# Altium project LimePSB-RPCM_1v5.PrjPcb (part 8 of 10)
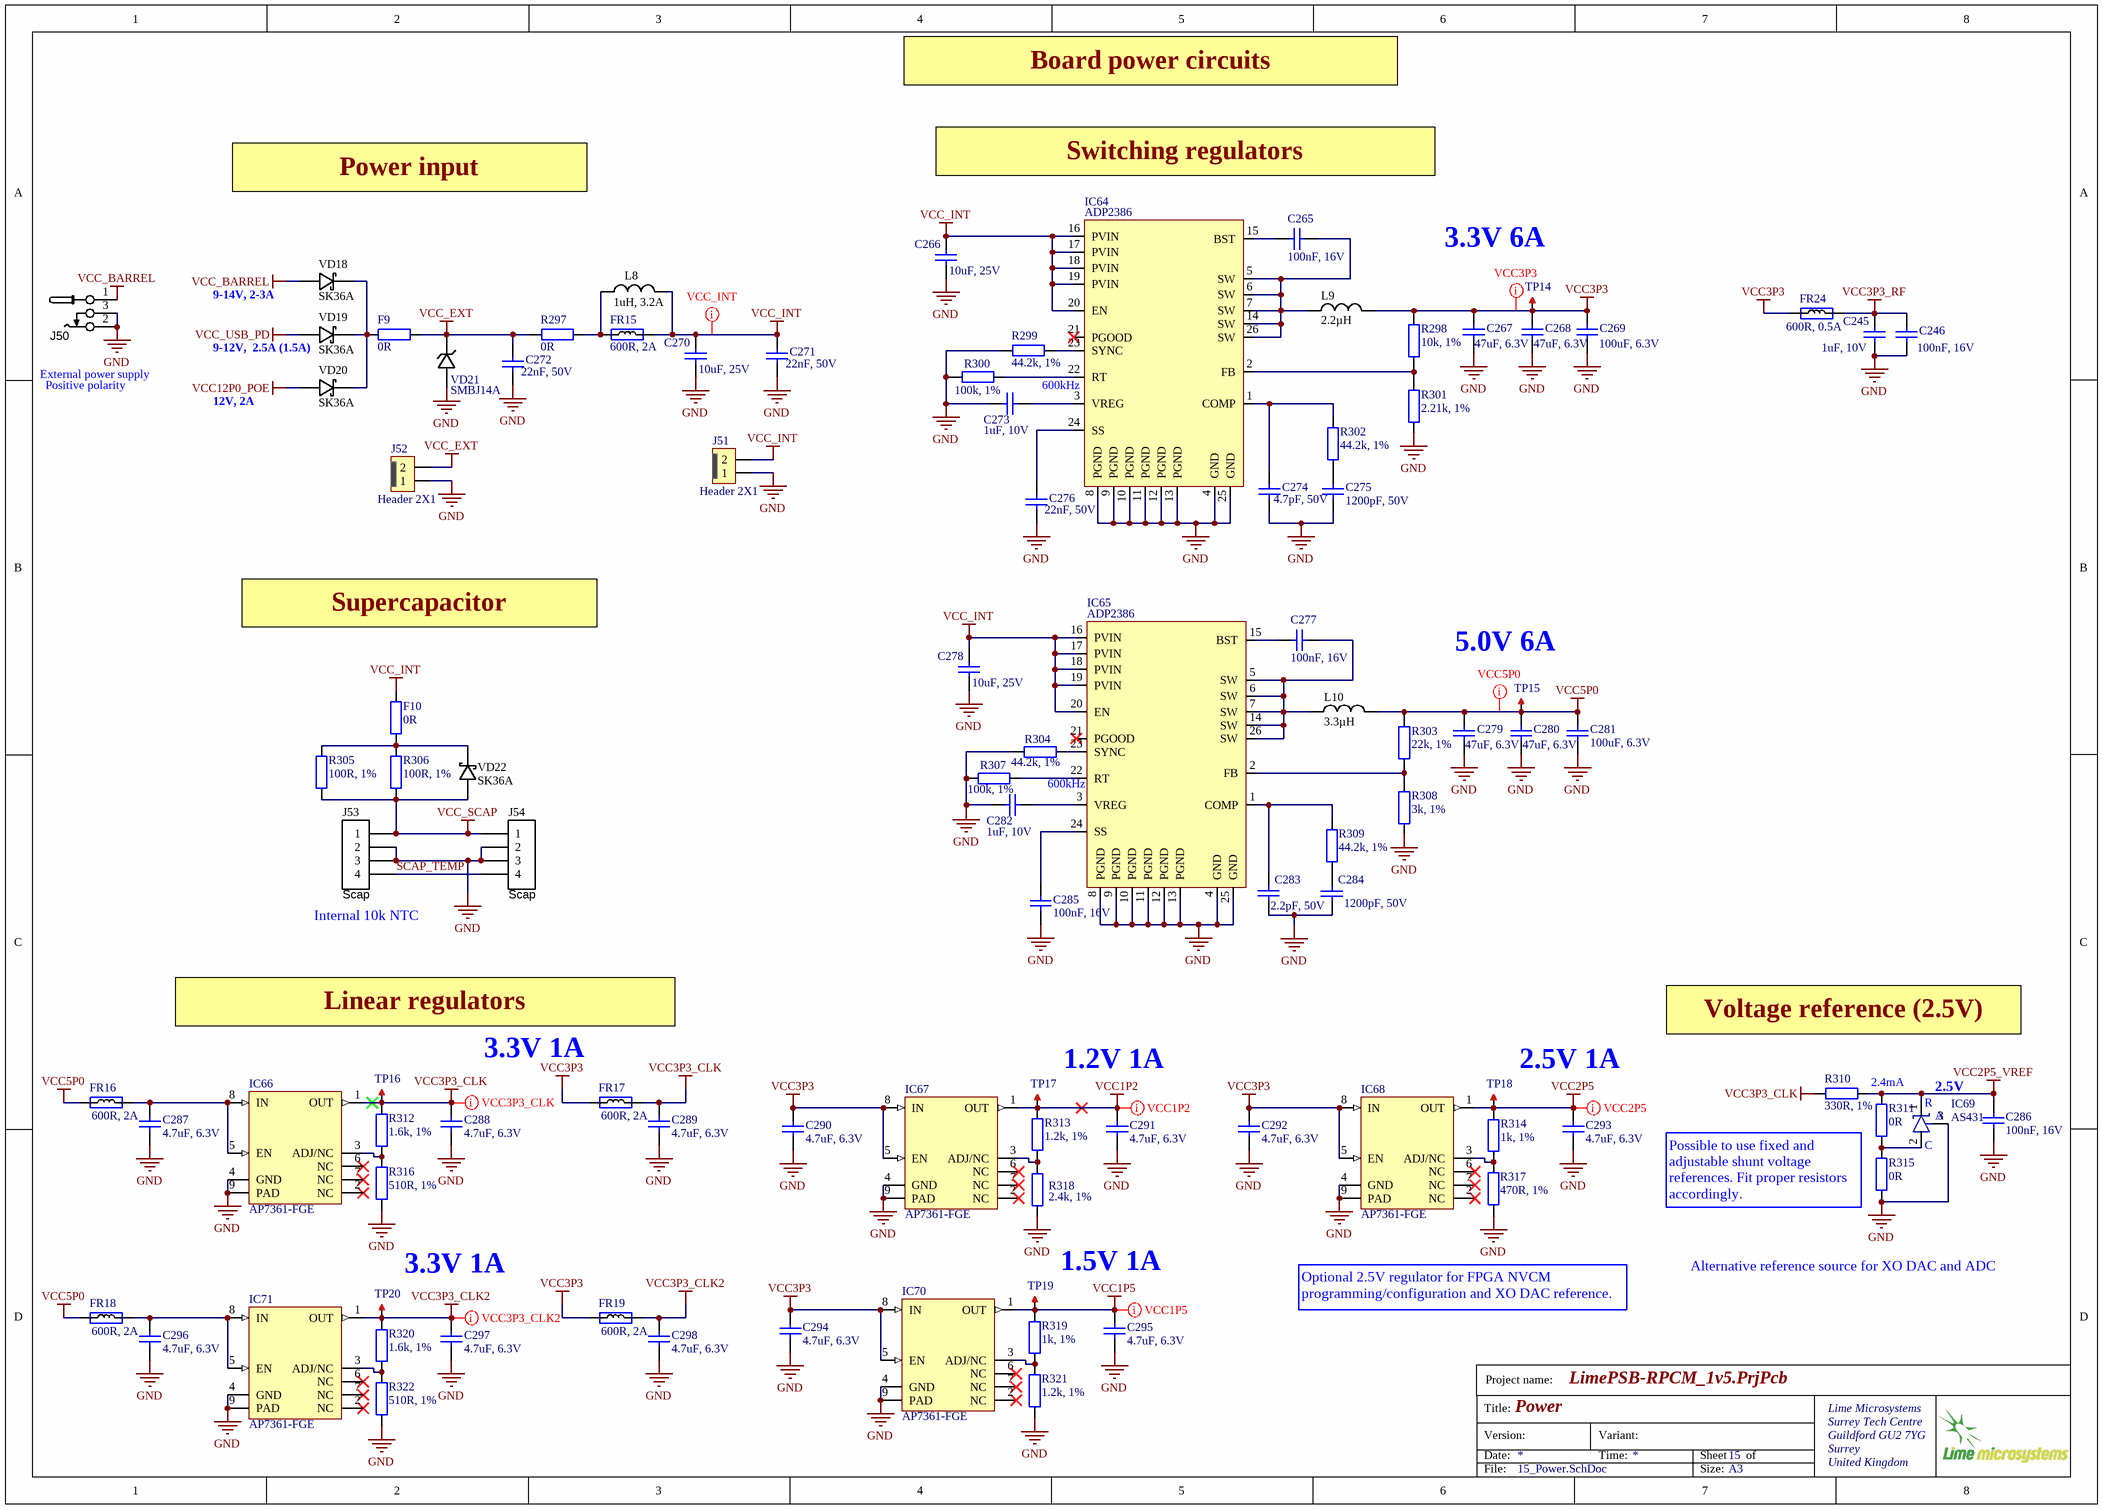
[diagram p11: 15_Power.SchDoc]

## Sheet 15_Power.SchDoc: Power (continued)

### Parts
C245  1uF, 10V  [CAP0402]
C246  100nF, 16V  [CAP0402]
C265  100nF, 16V  [CAP0402]
C266  10uF, 25V  [CAP0805]
C267  47uF, 6.3V  [CAP1206]
C268  47uF, 6.3V  [CAP1206]
C269  100uF, 6.3V  [CAP1206]
C270  10uF, 25V  [CAP0805]
C271  22nF, 50V  [CAP0402]
C272  22nF, 50V  [CAP0402]
C273  1uF, 10V  [CAP0402]
C274  4.7pF, 50V  [CAP0402]
C275  1200pF, 50V  [CAP0402]
C276  22nF, 50V  [CAP0402]
C277  100nF, 16V  [CAP0402]
C278  10uF, 25V  [CAP0805]
C279  47uF, 6.3V  [CAP1206]
C280  47uF, 6.3V  [CAP1206]
C281  100uF, 6.3V  [CAP1206]
C282  1uF, 10V  [CAP0402]
C283  2.2pF, 50V  [CAP0402]
C284  1200pF, 50V  [CAP0402]
C285  100nF, 16V  [CAP0402]
C286  100nF, 16V  [CAP0402]
C287  4.7uF, 6.3V  [CAP0402]
C288  4.7uF, 6.3V  [CAP0402]
C289  4.7uF, 6.3V  [CAP0402]
C290  4.7uF, 6.3V  [CAP0402]
C291  4.7uF, 6.3V  [CAP0402]
C292  4.7uF, 6.3V  [CAP0402]
C293  4.7uF, 6.3V  [CAP0402]
C294  4.7uF, 6.3V  [CAP0402]
C295  4.7uF, 6.3V  [CAP0402]
C296  4.7uF, 6.3V  [CAP0402]
C297  4.7uF, 6.3V  [CAP0402]
C298  4.7uF, 6.3V  [CAP0402]
F9  0R  [RES0805]
F10  0R  [RES0805]
FR15  600R, 2A  [RES0805]
FR16  600R, 2A  [RES0805]
FR17  600R, 2A  [RES0805]
FR18  600R, 2A  [RES0805]
FR19  600R, 2A  [RES0805]
FR24  600R, 0.5A  [RES0402]
IC64  ADP2386  [ADP2386]
IC65  ADP2386  [ADP2386]
IC66  AP7361-FGE  [AP7361]
IC67  AP7361-FGE  [AP7361]
IC68  AP7361-FGE  [AP7361]
IC69  AS431  [SOT23-3_v2]
IC70  AP7361-FGE  [AP7361]
IC71  AP7361-FGE  [AP7361]
J50  CONN_PWR_JACK_2.1x5.5mm  [CONN_PWR_JACK_v2]  (value not drawn)
J51  Header 2X1  [Header1x2_TH_LOCKING]
J52  Header 2X1  [Header1x2_TH_LOCKING]
J53  Scap  [874370443_1P5_SMD_HEADER]
J54  Scap  [HEADER4X1_TH]
L8  1uH, 3.2A  [NRS4018T3R3MDGJ_inductor]
L9  2.2µH  [FDVE1040_TOKO_INDUCTOR]
L10  3.3µH  [FDVE1040_TOKO_INDUCTOR]
R297  0R  [RES0805]
R298  10k, 1%  [RES0402]
R299  44.2k, 1%  [RES0402]
R300  100k, 1%  [RES0402]
R301  2.21k, 1%  [RES0402]
R302  44.2k, 1%  [RES0402]
R303  22k, 1%  [RES0402]
R304  44.2k, 1%  [RES0402]
R305  100R, 1%  [RES0805]
R306  100R, 1%  [RES0805]
R307  100k, 1%  [RES0402]
R308  3k, 1%  [RES0402]
R309  44.2k, 1%  [RES0402]
R310  330R, 1%  [RES0402]
R311  0R  [RES0402]
R312  1.6k, 1%  [RES0402]
R313  1.2k, 1%  [RES0402]
R314  1k, 1%  [RES0402]
R315  0R  [RES0402]
R316  510R, 1%  [RES0402]
R317  470R, 1%  [RES0402]
R318  2.4k, 1%  [RES0402]
R319  1k, 1%  [RES0402]
R320  1.6k, 1%  [RES0402]
R321  1.2k, 1%  [RES0402]
R322  510R, 1%  [RES0402]
TP14  TESTPOINT_PAD  [TP_PAD_1p5MM]  (value not drawn)  (no BOM)
TP15  TESTPOINT_PAD  [TP_PAD_1p5MM]  (value not drawn)  (no BOM)
TP16  TESTPOINT_PAD  [TP_PAD_1p5MM]  (value not drawn)  (no BOM)
TP17  TESTPOINT_PAD  [TP_PAD_1p5MM]  (value not drawn)  (no BOM)
TP18  TESTPOINT_PAD  [TP_PAD_1p5MM]  (value not drawn)  (no BOM)
TP19  TESTPOINT_PAD  [TP_PAD_1p5MM]  (value not drawn)  (no BOM)
TP20  TESTPOINT_PAD  [TP_PAD_1p5MM]  (value not drawn)  (no BOM)
VD18  SK36A  [SK32A-L_DIODE_DO-214AC]
VD19  SK36A  [SK32A-L_DIODE_DO-214AC]
VD20  SK36A  [SK32A-L_DIODE_DO-214AC]
VD21  SMBJ14A  [SMAJ12CA-13-F]
VD22  SK36A  [SK32A-L_DIODE_DO-214AC]

### Nets
GND: C245.1 C246.2 C266.1 C267.1 C268.1 C269.1 C270.1 C271.2 C272.2 C273.2 C274.2 C275.2 C276.2 C278.1 C279.1 C280.1 C281.1 C282.2 C283.2 C284.2 C285.1 C286.1 C287.1 C288.1 C289.1 C290.1 C291.1 C292.1 C293.1 C294.1 C295.1 C296.1 C297.1 C298.1 IC64.4(GND) IC64.8(PGND) IC64.9(PGND) IC64.10(PGND) IC64.11(PGND) IC64.12(PGND) IC64.13(PGND) IC64.25(GND) IC65.4(GND) IC65.8(PGND) IC65.9(PGND) IC65.10(PGND) IC65.11(PGND) IC65.12(PGND) IC65.13(PGND) IC65.25(GND) IC66.4(GND) IC66.9(PAD) IC67.4(GND) IC67.9(PAD) IC68.4(GND) IC68.9(PAD) IC69.3(NC/A) IC70.4(GND) IC70.9(PAD) IC71.4(GND) IC71.9(PAD) J50.2 J50.3 J51.1 J52.1 J53.2 J53.3 J54.2 J54.3 R299.2 R300.2 R301.1 R304.2 R307.2 R308.1 R315.2 R316.2 R317.2 R318.1 R321.2 R322.2 VD21.A
VCC1P2: C291.2 IC67.1(OUT) R313.1 TP17.1
VCC1P5: C295.2 IC70.1(OUT) R319.2 TP19.1
VCC2P5: C293.2 IC68.1(OUT) R314.2 TP18.1
VCC2P5_VREF: C286.2 IC69.1(K) R310.1 R311.1
VCC3P3: C267.2 C268.2 C269.2 C290.2 C292.2 C294.2 FR17.1 FR19.1 FR24.1 IC67.5(EN) IC67.8(IN) IC68.5(EN) IC68.8(IN) IC70.5(EN) IC70.8(IN) L9.2 R298.1 TP14.1
VCC3P3_CLK: C288.2 C289.2 FR17.2 IC66.1(OUT) R310.2 R312.2 TP16.1
VCC3P3_CLK2: C297.2 C298.2 FR19.2 IC71.1(OUT) R320.2 TP20.1
VCC3P3_RF: C245.2 C246.1 FR24.2
VCC5P0: C279.2 C280.2 C281.2 FR16.1 FR18.1 L10.2 R303.2 TP15.1
VCC12P0_POE: VD20.A
VCC_BARREL: J50.1 VD18.A
VCC_EXT: C272.1 F9.1 J52.2 R297.2 VD21.K
VCC_INT: C266.2 C270.2 C271.1 C278.2 F10.1 FR15.2 IC64.16(PVIN) IC64.17(PVIN) IC64.18(PVIN) IC64.19(PVIN) IC64.20(EN) IC65.16(PVIN) IC65.17(PVIN) IC65.18(PVIN) IC65.19(PVIN) IC65.20(EN) J51.2 L8.2
VCC_SCAP: J53.1 J54.1 R305.2 R306.2 VD22.A
VCC_USB_PD: VD19.A
SCAP_TEMP: J53.4 J54.4
NetC265_1: C265.1 IC64.15(BST)
NetC265_2: C265.2 IC64.5(SW) IC64.6(SW) IC64.7(SW) IC64.14(SW) IC64.26(SW) L9.1
NetC273_1: C273.1 IC64.3(VREG)
NetC274_1: C274.1 IC64.1(COMP) R302.2
NetC275_1: C275.1 R302.1
NetC276_1: C276.1 IC64.24(SS)
NetC277_1: C277.1 IC65.15(BST)
NetC277_2: C277.2 IC65.5(SW) IC65.6(SW) IC65.7(SW) IC65.14(SW) IC65.26(SW) L10.1
NetC282_1: C282.1 IC65.3(VREG)
NetC283_1: C283.1 IC65.1(COMP) R309.2
NetC284_1: C284.1 R309.1
NetC285_2: C285.2 IC65.24(SS)
NetC287_2: C287.2 FR16.2 IC66.5(EN) IC66.8(IN)
NetC296_2: C296.2 FR18.2 IC71.5(EN) IC71.8(IN)
NetF9_2: F9.2 VD18.K VD19.K VD20.K
NetF10_2: F10.2 R305.1 R306.1 VD22.K
NetFR15_1: FR15.1 L8.1 R297.1
NetIC64_2: IC64.2(FB) R298.2 R301.2
NetIC64_22: IC64.22(RT) R300.1
NetIC64_23: IC64.23(SYNC) R299.1
NetIC65_2: IC65.2(FB) R303.1 R308.2
NetIC65_22: IC65.22(RT) R307.1
NetIC65_23: IC65.23(SYNC) R304.1
NetIC66_3: IC66.3(ADJ/NC) R312.1 R316.1
NetIC67_3: IC67.3(ADJ/NC) R313.2 R318.2
NetIC68_3: IC68.3(ADJ/NC) R314.1 R317.1
NetIC69_2: IC69.2(A) R311.2 R315.1
NetIC70_3: IC70.3(ADJ/NC) R319.1 R321.1
NetIC71_3: IC71.3(ADJ/NC) R320.1 R322.1

Not connected (* = marked no-connect by the designer): IC64 21(PGOOD)*; IC65 21(PGOOD)*; IC66 2(NC)* 6(NC)* 7(NC)*; IC67 2(NC)* 6(NC)* 7(NC)*; IC68 2(NC)* 6(NC)* 7(NC)*; IC70 2(NC)* 6(NC)* 7(NC)*; IC71 2(NC)* 6(NC)* 7(NC)*

### Layout directives
net class VCC1P5: VCC1P5
net class VCC3P3_CLK: VCC3P3_CLK
net class VCC3P3: VCC3P3
net class VCC_INT: VCC_INT
net class VCC5P0: VCC5P0
net class VCC1P2: VCC1P2
net class VCC3P3_CLK2: VCC3P3_CLK2
net class VCC2P5: VCC2P5

### Notes on the sheet
- Board power circuits
- Switching regulators
- Power input
- (near TP14) 3.3V 6A
- 9-14V, 2-3A
- (near J50) External power supply
- (near VD19) 9-12V,  2.5A (1.5A)
- (near J50) Positive polarity
- 12V, 2A
- (near IC64) 600kHz
- Supercapacitor
- (near TP15) 5.0V 6A
- (near IC65) 600kHz
- (near J53) Internal 10k NTC
- Linear regulators
- Voltage reference (2.5V)
- 3.3V 1A
- 1.2V 1A
- 2.5V 1A
- 2.4mA
- (near IC69) R
- (near IC69) A
- 2.5V
- (near IC69) C
- Possible to use fixed and adjustable shunt voltage references. Fit proper resistors accordingly.
- 1.5V 1A
- Optional 2.5V regulator for FPGA NVCM programming/configuration and XO DAC reference.
- Alternative reference source for XO DAC and ADC
- Project name:
- Title:
- Version:
- Date:
- Variant:
- Time:
- Sheet
- of
- File:
- Size:
- A3